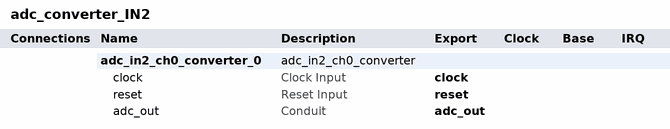
[diagram p0: system contents]
# Platform Designer (Qsys) system adc_converter_IN2, MAX 10 10M50DAF484C6GES
# Parameters at their usual value, and those the tool derives, are not listed.
package require qsys
create_system adc_converter_IN2
set_project_property DEVICE_FAMILY {MAX 10}
set_project_property DEVICE 10M50DAF484C6GES

add_instance adc_in2_ch0_converter_0 adc_in2_ch0_converter 1.0
set_instance_property adc_in2_ch0_converter_0 AUTO_EXPORT true

# exported interfaces
add_interface adc_out conduit end
set_interface_property adc_out EXPORT_OF adc_in2_ch0_converter_0.adc_out
add_interface clock clock sink
set_interface_property clock EXPORT_OF adc_in2_ch0_converter_0.clock
add_interface reset reset sink
set_interface_property reset EXPORT_OF adc_in2_ch0_converter_0.reset

set_interconnect_requirement {$system} qsys_mm.clockCrossingAdapter HANDSHAKE
set_interconnect_requirement {$system} qsys_mm.enableEccProtection FALSE
set_interconnect_requirement {$system} qsys_mm.insertDefaultSlave FALSE
set_interconnect_requirement {$system} qsys_mm.maxAdditionalLatency 1

save_system adc_converter_IN2.qsys
